# EAGLE design Water_Monitor_Interface_v7 (EAGLE 9.6.2)
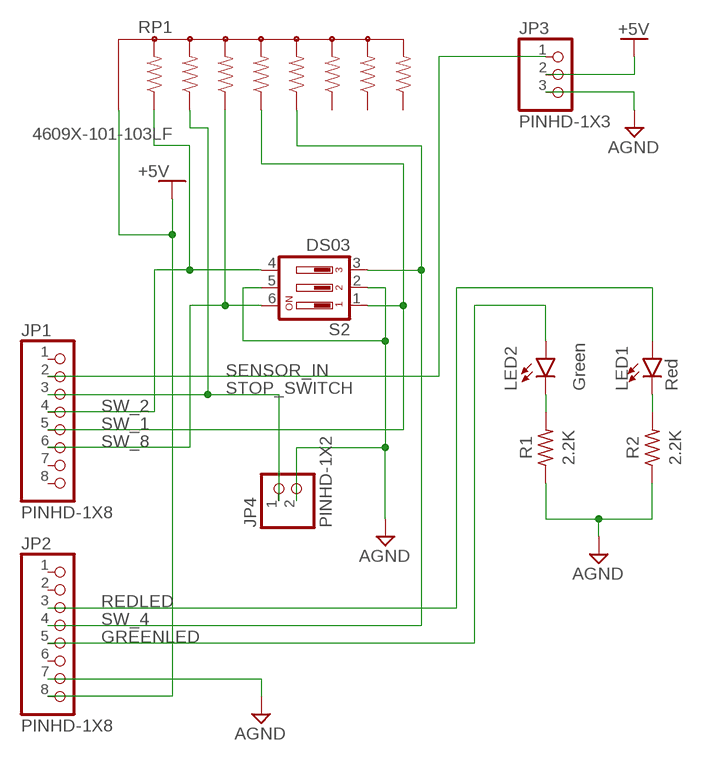
[diagram p0: schematic, sheet 1]

## Parts
JP1  PINHD-1X8  [1X08]
JP2  PINHD-1X8  [1X08]
JP3  PINHD-1X3  [1X03]
JP4  PINHD-1X2  [1X02]
LED1  Red  LED3MM  [LED3MM]
LED2  Green  LED-3MM-NO_SILK  [LED_3MM-NS]
R1  2.2K  R-US_AXIAL-7.2MM-PITCH  [RESAD724W46L381D178B]
R2  2.2K  R-US_AXIAL-7.2MM-PITCH  [RESAD724W46L381D178B]
RP1  4609X-101-103LF  [4609X-101-103LF]
S2  DS03  [DS-03]

## Nets
+5V [Power]: JP2.8 JP3.2 RP1.1
AGND [Ground]: JP2.7 JP3.3 JP4.2 R1.1 R2.1 S2.2 S2.5
GREENLED: JP2.5 LED2.A
N$2: LED1.K(C) R2.2
N$3: LED2.K(C) R1.2
REDLED: JP2.3 LED1.A
SENSOR_IN: JP1.2 JP3.1
STOP_SWITCH: JP1.3 JP4.1 RP1.3
SW_1: JP1.5 RP1.5 S2.1
SW_2: JP1.4 RP1.2 S2.4
SW_4: JP2.4 RP1.6 S2.3
SW_8: JP1.6 RP1.4 S2.6
Unconnected: JP1.1 JP1.7 JP1.8 JP2.1 JP2.2 JP2.6 RP1.7 RP1.8 RP1.9

## Library data of the parts
JP1 JP2 = Connector:PINHD-1X8: PIN HEADER; CATEGORY: CONNECTOR; SUB-CATEGORY: PIN-HEADER
JP3 = Connector:PINHD-1X3: PIN HEADER; CATEGORY: CONNECTOR; SUB-CATEGORY: PIN-HEADER
JP4 = Connector:PINHD-1X2: PIN HEADER; CATEGORY: CONNECTOR; SUB-CATEGORY: PIN-HEADER
LED1 = led:LED: LED OSRAM: - CHIPLED LG R971, LG N971, LY N971, LG Q971, LY Q971, LO R971, LY R971 LH N974, LH R974 LS Q976, LO Q976, LY Q976 LO Q996 - Hyper CHIPLED LW Q18S LB Q993, LB Q99A, LB R99A - SideLED LS A670, LO A670, LY A670, LG A670, LP A670 LB A673, LV A673, LT A673, LW A673 LH A674 LY A675 LS A676, LA A676, LO A676, LY A676, LW A676 LS A679, LY A679, LG A679 - Hyper Micro SIDELED® LS Y876, LA Y876, LO Y876, LY Y876 LT Y87S - SmartLED LW L88C, LW L88S LB L89C, LB L89S, LG L890 LS L89K, LO L89K, LY L89K LS L896, LA L896, LO L896, LY L896 - TOPLED LS T670, LO T670, LY T670, LG T670, LP T670 LSG T670, LSP T670, LSY T670, LOP T670, LYG T670 LG T671, LOG T671, LSG T671 LB T673, LV T673, LT T673, LW T673 LH T674 LS T676, LA T676, LO T676, LY T676, LB T676, LH T676, LSB T676, LW T676 LB T67C, LV T67C, LT T67C, LS T67K, LO T67K, LY T67K, LW E67C LS E67B, LA E67B, LO E67B, LY E67B, LB E67C, LV E67C, LT E67C LW T67C LS T679, LY T679, LG T679 LS T770, LO T770, LY T770, LG T770, LP T770 LB T773, LV T773, LT T773, LW T773 LH T774 LS E675, LA E675, LY E675, LS T675 LS T776, LA T776, LO T776, LY T776, LB T776 LHGB T686 LT T68C, LB T68C - Hyper Mini TOPLED® LB M676 - Mini TOPLED Santana® LG M470 LS M47K, LO M47K, LY M47K Source: http://www.osram.convergy.de LUXEON: - LUMILED® LXK2-PW12-R00, LXK2-PW12-S00, LXK2-PW14-U00, LXK2-PW14-V00 LXK2-PM12-R00, LXK2-PM12-S00, LXK2-PM14-U00 LXK2-PE12-Q00, LXK2-PE12-R00, LXK2-PE12-S00, LXK2-PE14-T00, LXK2-PE14-U00 LXK2-PB12-K00, LXK2-PB12-L00, LXK2-PB12-M00, LXK2-PB14-N00, LXK2-PB14-P00, LXK2-PB14-Q00 LXK2-PR12-L00, LXK2-PR12-M00, LXK2-PR14-Q00, LXK2-PR14-R00 LXK2-PD12-Q00, LXK2-PD12-R00, LXK2-PD12-S00 LXK2-PH12-R00, LXK2-PH12-S00 LXK2-PL12-P00, LXK2-PL12-Q00, LXK2-PL12-R00 Source: www.luxeon.com KINGBRIGHT: KA-3528ASYC Source: www.kingbright.com
LED2 = LEDs:LED: LED (Generic) Standard schematic elements and footprints for 5mm, 3mm, 1206, and 0603 sized LEDs. Generic LEDs with no color specified.
R1 R2 = Resistor:R-US: Resistor Fixed - ANSI; CATEGORY: Resistor; SUB-CATEGORY: Fixed
RP1 = Resistor Array:4609X-101-103LF: RES ARRAY 8 RES 10K OHM 9SIP Manufacturer's datasheet <https://www.bourns.com/docs/Product-Datasheets/4600x.pdf>; CREATED_BY: PCBLayout.com; DIGIKEY_PN: 4609X-101-103LF-ND; MANUFACTURER: Bourns Inc.; MPN: 4609X-101-103LF; PACKAGE: SIP-9
S2 = Switch:DS03: DIL/CODE SWITCH; CATEGORY: SWITCH; MPN: MCNDS-03-V; TYPE: SPST

## Net classes
0 default: width 0.305 mm
1 Ground: width 0.813 mm
2 Power: width 0.813 mm

## Board
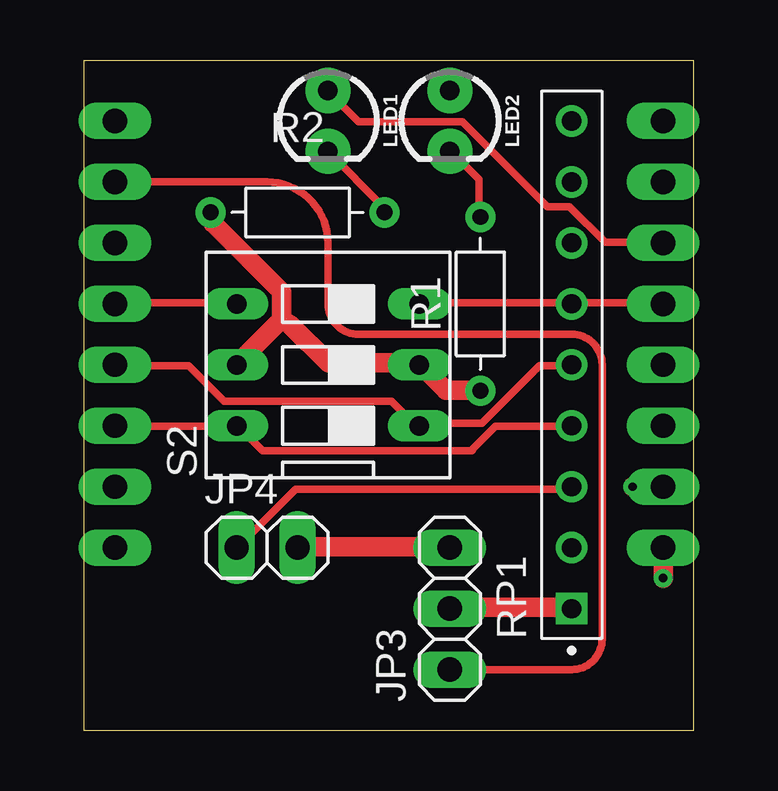
[diagram p1: board, top side]
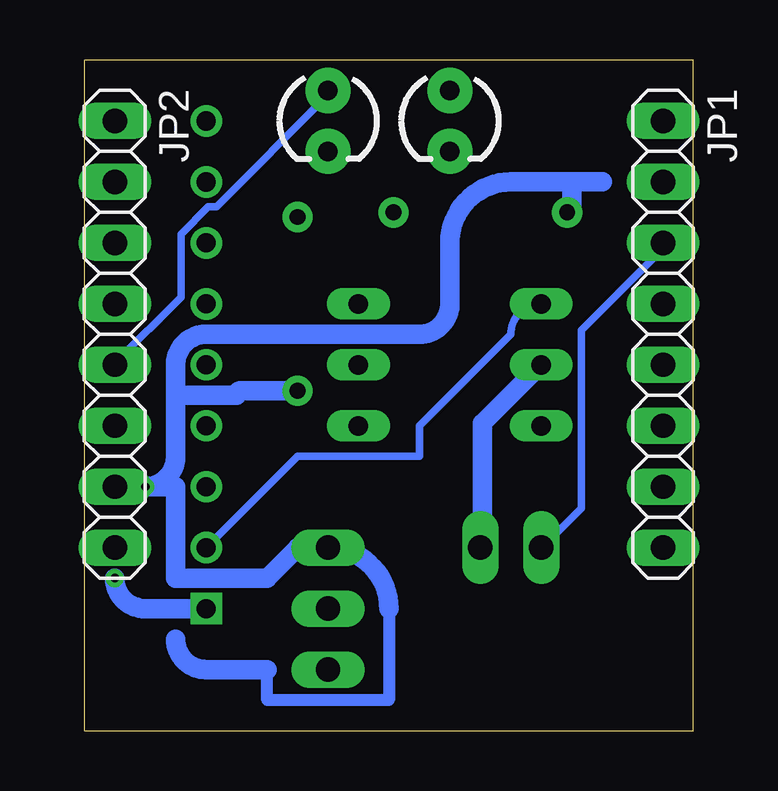
[diagram p2: board, bottom side, seen from below]

Size 25.4 x 27.94 mm. Coordinates in mm from the lower left corner, seen from the top.
Outline: 0,0 0,27.94 25.4,27.94 25.4,0 0,0
Copper layers (1*16): Top 0.035mm / dielectric 1.5mm / Bottom 0.035mm
Design rules "default": minimum track width 6mil, minimum drill 0.35mm, track to track 6mil, track to pad 6mil, pad to pad 6mil, via to via 6mil, smd to smd 6mil, copper to edge 40mil, drill to drill 6mil, minimum pad ring 10mil, minimum via ring 8mil, stop-mask expansion 4mil, vias tented up to drill 0mil, thermal gap 10mil

### Footprints (pad centres in the part's own frame; a part is rotated, then mirrored left to right if it is on the bottom)
1X08 = drill 1.016 long: 1 -8.89,0; 2 -6.35,0; 3 -3.81,0; 4 -1.27,0; 5 1.27,0; 6 3.81,0; 7 6.35,0; 8 8.89,0
1X03 = drill 1.016 long: 1 -2.54,0; 2 0,0; 3 2.54,0
1X02 = drill 1.016 long: 1 -1.27,0; 2 1.27,0
LED_3MM = drill 0.813 pad 1.88: A -1.27,0; K 1.27,0
RESAD724W46L381D178B = drill 0.66 pad 1.26: 1 -3.62,0; 2 3.62,0
4609X-101-103LF = drill 0.8 square: 1 0,0 | drill 0.8: 2 2.54,0; 3 5.08,0; 4 7.62,0; 5 10.16,0; 6 12.7,0; 7 15.24,0; 8 17.78,0; 9 20.32,0
DS-03 = drill 0.813 long: 1 -2.54,-3.81; 2 0,-3.81; 3 2.54,-3.81; 4 2.54,3.81; 5 0,3.81; 6 -2.54,3.81

### Placement (x,y rotation side)
JP1  1.27,16.51 270 bottom
JP2  24.13,16.51 270 bottom
JP3  15.24,5.08 90 top
JP4  7.62,7.62 0 top
LED1  Red  [LED_3MM]  10.16,25.4 270 top
LED2  Green  [LED_3MM]  15.24,25.4 270 top
R1  16.51,17.78 90 top
R2  8.89,21.59 0 top
RP1  20.32,5.08 90 top
S2  10.16,15.24 90 top

### Tracks (layer width: path | path; a pad name or v marks a point on that pad's centre or on a via)
+5V  (via drill 0.35)
  Top 0.813: RP1.1 20.23,5.14 15.32,5.14 JP3.2 | v24.13,6.35 JP2.8
  Bottom 0.813: RP1.1 22.86,5.08 arc90 v24.13,6.35
AGND  (via drill 0.35)
  Top 0.813: JP4.2 8.91,7.66 15.2,7.66 JP3.3 | R1.1 16.46,14.17 15.09,14.17 14.06,15.2 S2.2 13.6,15.32 10.17,15.32 8.57,16.92 8.23,17.14 | 8.23,17.14 8.23,18.29 5.37,21.14 5.37,21.49 R2.1 | 8.23,17.14 6.4,15.32 S2.5 | JP2.7 v22.86,10.16
  Bottom 0.508: 12.7,5.08 12.7,1.27 17.78,1.27 17.78,2.54
  Bottom 0.813: JP4.2 8.8,7.66 8.8,12.8 6.4,15.2 S2.5 | R1.1 18.86,14.16 arc-90 19.05,13.97 21.59,13.97 | 21.59,13.97 21.59,11.43 | 21.59,11.43 arc90 v22.86,10.16 | 5.08,21.78 arc90 R2.1 arc-90 5.08,21.78 | 5.08,22.86 3.81,22.86 | 5.08,21.78 5.08,22.86 | 21.59,13.97 21.59,15.24 arc90 20.32,16.51 11.43,16.51 arc-90 10.16,17.78 10.16,20.32 arc90 7.62,22.86 5.08,22.86 | 21.59,11.43 arc90 v22.86,10.16 | v22.86,10.16 21.59,10.16 21.59,6.35 17.78,6.35 16.51,7.62 JP3.3 arc90 12.7,5.08 | 17.78,2.54 20.32,2.54 arc90 21.59,3.81
GREENLED  (via drill 0.35)
  Top 0.305: v24.12,15.32 JP2.5
  Bottom 0.305: v24.12,15.32 21.37,18.06 21.37,20.69 20.23,21.83 19.89,21.83 15.32,26.4 15.32,26.63 LED2.A
N$2
  Top 0.305: LED1.K 12.46,21.83 12.46,21.6 R2.2
N$3
  Top 0.305: R1.2 16.46,21.49 16.46,22.97 15.32,24.12 LED2.K
REDLED  (via drill 0.35)
  Top 0.305: v24.12,20.34 21.72,20.34 20.23,21.83 19.32,21.83 15.77,25.38 11.43,25.38 10.17,26.63 LED1.A
  Bottom 0.305: v24.12,20.34 JP2.3
SENSOR_IN
  Top 0.305: JP1.2 7.62,22.86 arc-90 10.16,20.32 10.16,17.78 arc90 11.43,16.51 20.32,16.51 arc-90 21.59,15.24 21.59,3.81 arc-90 20.32,2.54 JP3.1
STOP_SWITCH  (via drill 0.35)
  Top 0.305: RP1.3 20.23,10.06 8.8,10.06 6.4,7.66 JP4.1 | v1.37,20.23 1.27,20.33 JP1.3
  Bottom 0.305: v1.37,20.23 1.37,20 4.69,16.69 4.69,9.26 6.29,7.66 JP4.1
SW_1  (via drill 0.35)
  Top 0.305: RP1.5 20.23,15.2 18.97,15.2 16.57,12.8 14.06,12.8 S2.1 13.83,12.69 12.8,13.72 5.83,13.72 4.34,15.2 v1.37,15.2
  Bottom 0.305: v1.37,15.2 1.33,15.24 JP1.5
SW_2  (via drill 0.35)
  Top 0.305: v1.37,17.83 6.29,17.83 S2.4
  Bottom 0.305: v1.37,17.83 1.27,17.83 JP1.4 | S2.4 arc-90 7.62,16.51 11.43,12.7 11.43,11.43 16.51,11.43 RP1.2
SW_4  (via drill 0.35)
  Top 0.305: v24.12,17.83 20.34,17.83 RP1.6 20.23,17.83 14.06,17.83 S2.3
  Bottom 0.305: v24.12,17.83 JP2.4
SW_8  (via drill 0.35)
  Top 0.305: 16.12,11.66 16.2,11.74 | 16.2,11.74 17.14,12.69 20.23,12.69 RP1.4 | v1.37,12.69 6.29,12.69 S2.6 6.4,12.69 7.43,11.66 16.12,11.66 | 16.12,11.66 arc90 16.2,11.74
  Bottom 0.305: v1.37,12.69 1.36,12.7 JP1.6